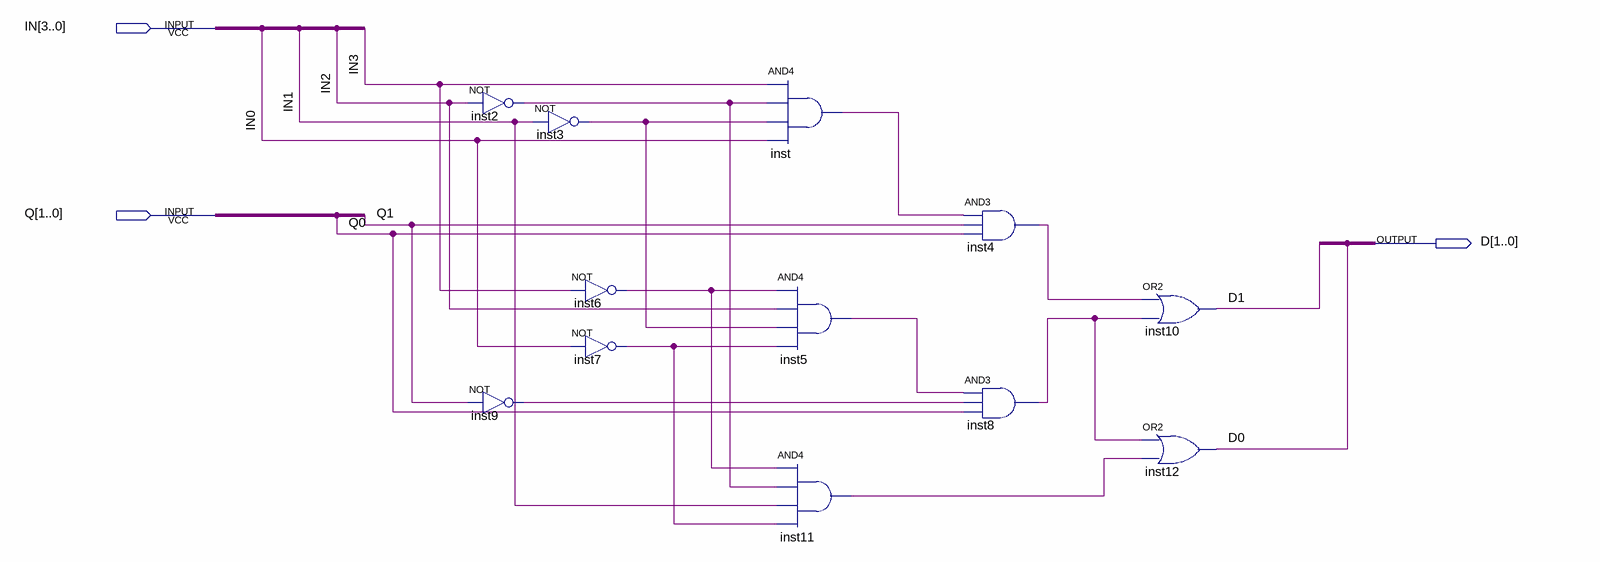
[diagram p0: schematic sheet]
// Quartus schematic NextStateConverterMealy.bdf as structural Verilog: 12 symbols, 3 pins
module NextStateConverterMealy (
  input  [3:0] IN,
  input  [1:0] Q,
  output [1:0] D
);

  wire inst2_out, inst3_out, inst4_out, inst5_out, inst6_out, inst7_out, inst8_out, inst9_out, inst11_out,
       inst_out;

  not inst2 (inst2_out, IN[2]);
  not inst9 (inst9_out, Q[1]);
  not inst3 (inst3_out, IN[1]);
  not inst6 (inst6_out, IN[3]);
  not inst7 (inst7_out, IN[0]);
  and inst (inst_out, IN[3], inst2_out, inst3_out, IN[0]);
  and inst5 (inst5_out, inst6_out, IN[2], inst3_out, inst7_out);
  and inst11 (inst11_out, inst6_out, inst2_out, IN[1], inst7_out);
  and inst4 (inst4_out, inst_out, Q[1], Q[0]);
  and inst8 (inst8_out, inst5_out, inst9_out, Q[0]);
  or inst10 (D[1], inst4_out, inst8_out);
  or inst12 (D[0], inst8_out, inst11_out);
endmodule
